# EAGLE design pedalswitch (EAGLE 5.07)
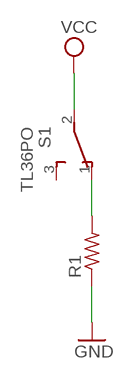
[diagram p0: schematic, sheet 1]

## Parts
R1  R-US_0204/2V  [0204V]
S1  TL36PO  [TL3XPO]

## Nets
GND: R1.1
N$1: R1.2 S1.1(O)
VCC: S1.2(P)
Unconnected: S1.3(S)

## Library data of the parts
R1 = resistor:R-US_: RESISTOR, American symbol
S1 = switch:TL36PO: TINY SWITCH ON - ON Source: http://www2.produktinfo.conrad.com/datenblaetter/700000-724999/705152-da-01-de-Subminiaturschalter_TL_36YO.pdf

## Board
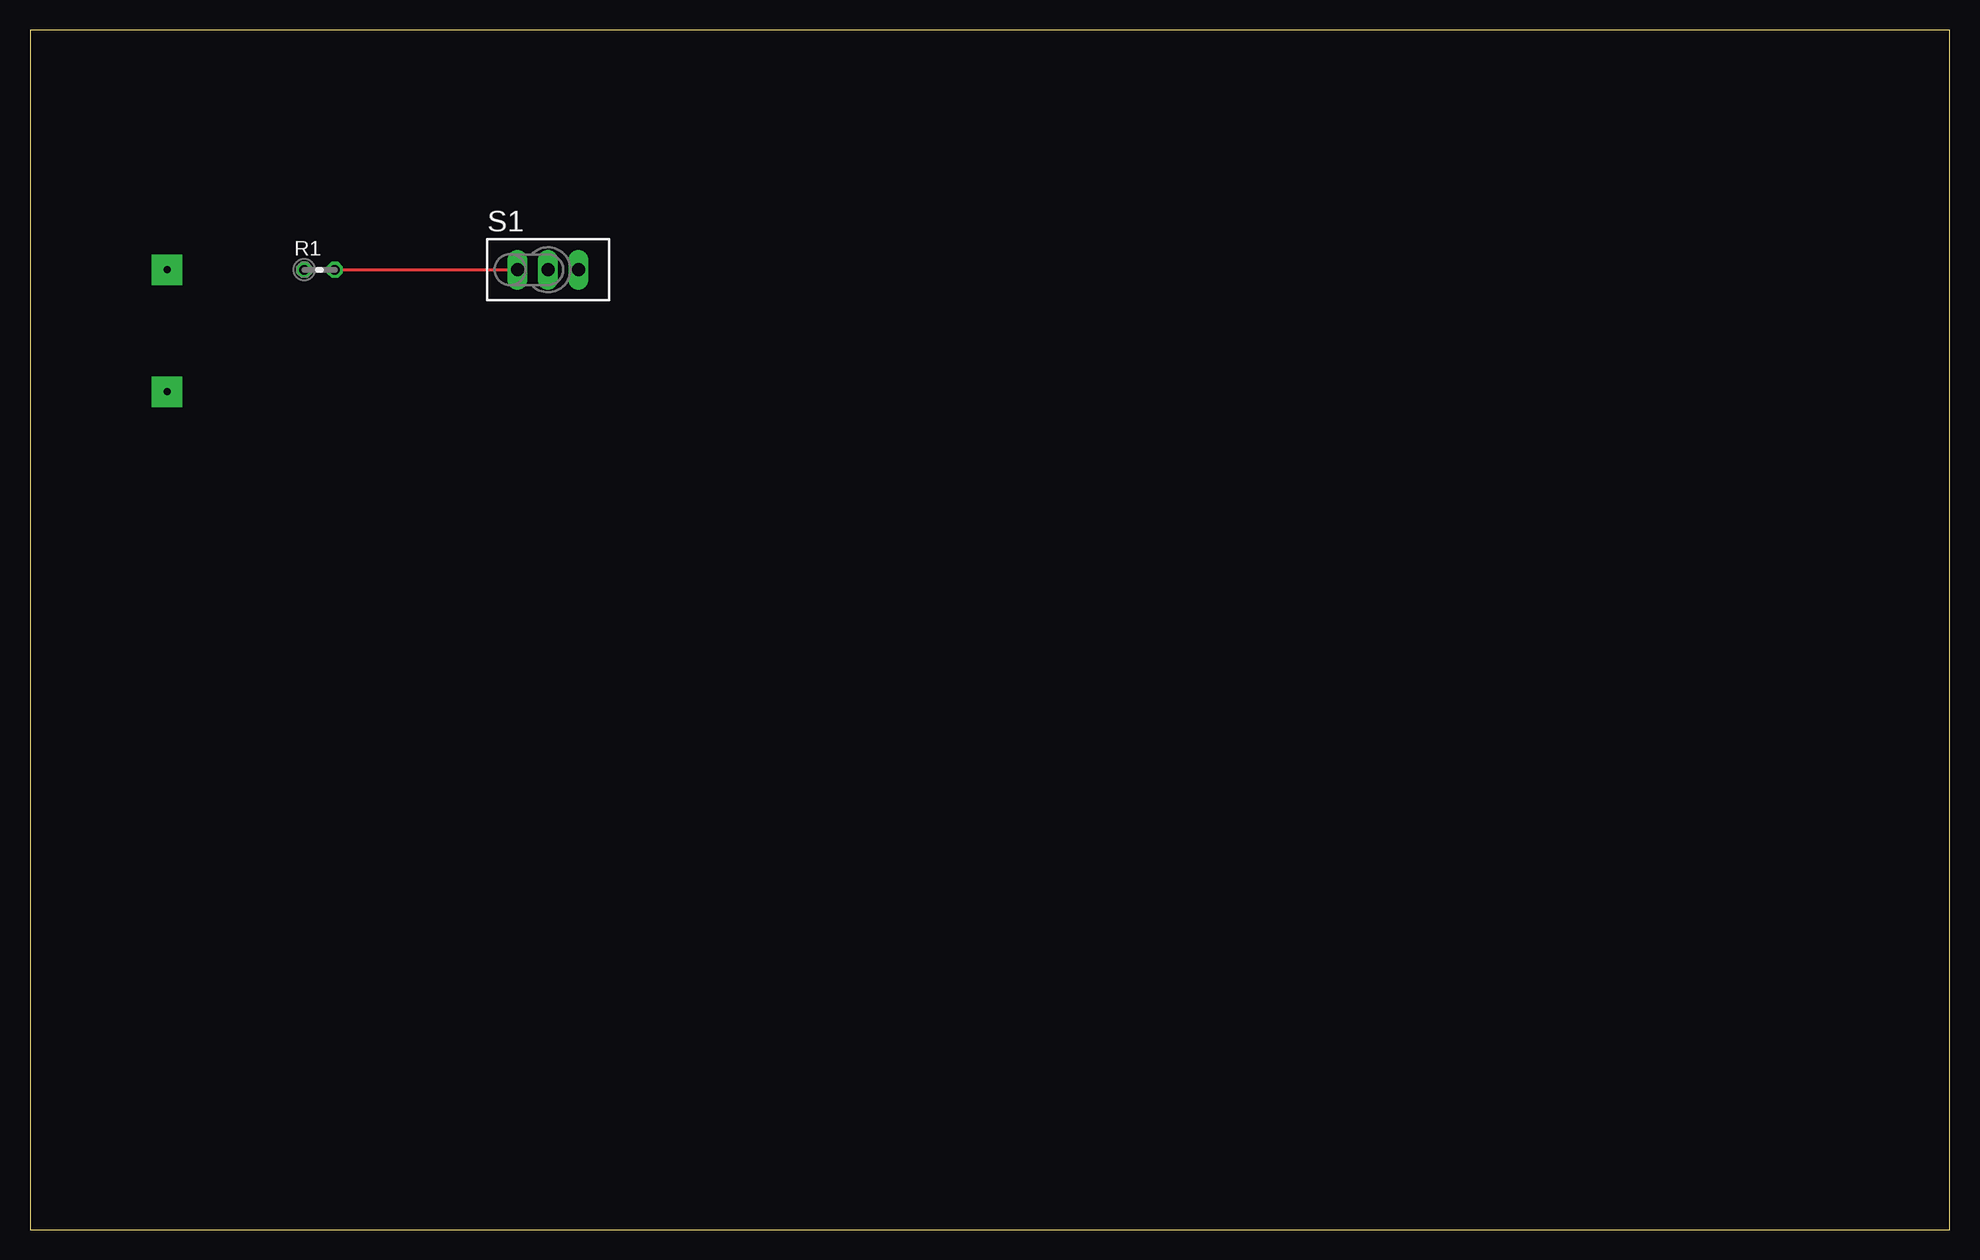
[diagram p1: board, top side]

Size 160 x 100 mm. Coordinates in mm from the lower left corner, seen from the top.
Outline: 0,0 160,0 160,100 0,100 0,0
Copper layers (1*16): Top 0.035mm / dielectric 1.5mm / Bottom 0.035mm
Design rules "default": minimum track width 10mil, minimum drill 24mil, track to track 8mil, track to pad 8mil, pad to pad 8mil, via to via 8mil, smd to smd 8mil, copper to edge 40mil, drill to drill 8mil, minimum pad ring 10mil, minimum via ring 8mil, stop-mask expansion 4mil, vias tented up to drill 0mil, thermal gap 10mil

### Footprints (pad centres in the part's own frame; a part is rotated, then mirrored left to right if it is on the bottom)
0204V = drill 0.813 octagon: 1 -1.27,0; 2 1.27,0
TL3XPO = drill 1.1 pad 1.422 long: 1 -2.54,0; 2 0,0; 3 2.54,0

### Placement (x,y rotation side)
R1  24.13,80.01 0 top
S1  43.18,80.01 0 top

### Tracks (layer width: path | path; a pad name or v marks a point on that pad's centre or on a via)
N$1
  Top 0.254: R1.2 S1.1
N$2  (via drill 0.6 pad 2.54)
  other vias: 11.43,69.85
N$3  (via drill 0.6 pad 2.54)
  other vias: 11.43,80.01